# Altium schematic sheet Bluetooth & WIFI.SchDoc: BLUETOOTH & WiFi
size A4
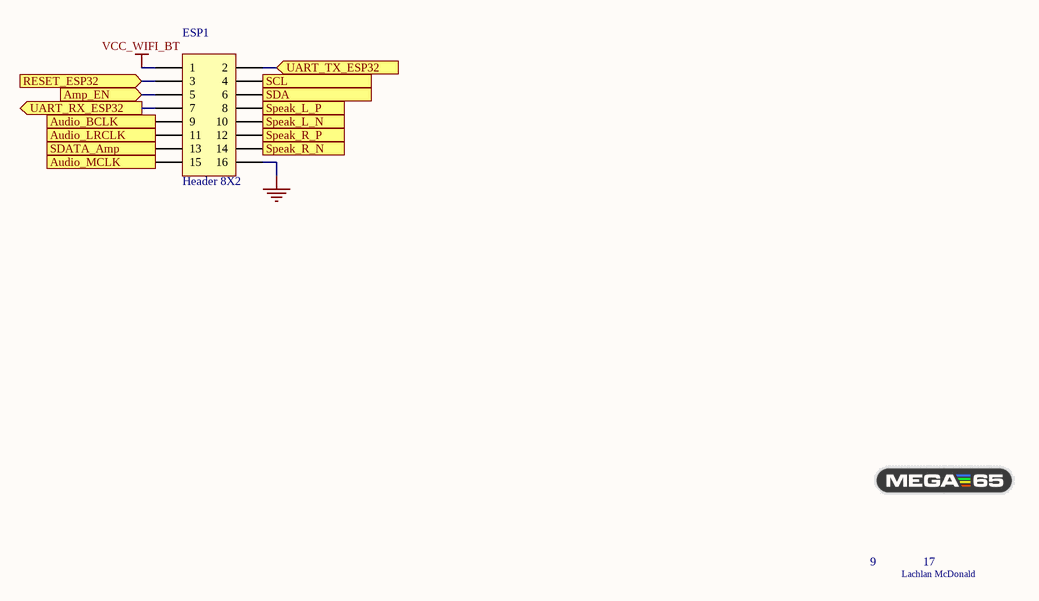
[diagram p0: Bluetooth & WIFI.SchDoc]

## Parts
ESP1  Header 8X2  [HDR2X8]

## Ports
Amp_EN (in), Audio_BCLK (in), Audio_LRCLK (in), Audio_MCLK (in), RESET_ESP32 (in), SCL (in), SDA (out), SDATA_Amp (in), Speak_L_N (out), Speak_L_P (out), Speak_R_N (out), Speak_R_P (out), UART_RX_ESP32 (out), UART_TX_ESP32 (in)

## Nets
GND: ESP1.16
VCC_WIFI_BT: ESP1.1
Amp_EN: ESP1.5 ; port Amp_EN
Audio_BCLK: ESP1.9 ; port Audio_BCLK
Audio_LRCLK: ESP1.11 ; port Audio_LRCLK
Audio_MCLK: ESP1.15 ; port Audio_MCLK
RESET_ESP32: ESP1.3 ; port RESET_ESP32
SCL: ESP1.4 ; port SCL
SDA: ESP1.6 ; port SDA
SDATA_Amp: ESP1.13 ; port SDATA_Amp
Speak_L_N: ESP1.10 ; port Speak_L_N
Speak_L_P: ESP1.8 ; port Speak_L_P
Speak_R_N: ESP1.14 ; port Speak_R_N
Speak_R_P: ESP1.12 ; port Speak_R_P
UART_RX_ESP32: ESP1.7 ; port UART_RX_ESP32
UART_TX_ESP32: ESP1.2 ; port UART_TX_ESP32

## Notes on the sheet
- 9
- 17
- Lachlan McDonald
- Title
- Size:
- Date:
- A4
- Number:
- Revision:
- Sheet
- Drawn By:
- of
- File:

## Library data of the parts
ESP1 = Header 8X2: Header, 8-Pin, Dual row; LatestRevisionDate: 17-Jul-2002; LatestRevisionNote: Re-released for DXP Platform.; Publisher: Altium Limited